# Altium schematic sheet SD Card.SchDoc
size A; SheetNumber: 3; SheetTotal: 7
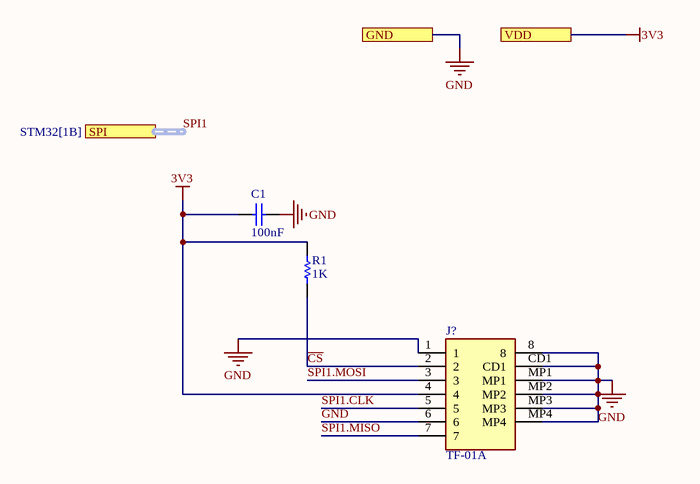
[diagram p0: SD Card.SchDoc]

## Parts
C1  value 100nF  (hidden comment: Capacitor)
J?  TF-01A  [TF01A]
R1  value 1K  (hidden comment: Resistor)

## Ports
GND, SPI (harness SPI Connection, see STM32[1B]), VDD

## Nets
3V3: C1.1 J?.4 R1.2 ; port VDD
GND: C1.2 J?.1 J?.6 J?.8 J?.CD1 J?.MP1 J?.MP2 J?.MP3 J?.MP4 ; port GND
~{CS}: J?.2 R1.1
SPI1.CLK: J?.5
SPI1.MISO: J?.7
SPI1.MOSI: J?.3

## Buses and harness runs
harness SPI1 = port SPI

## Library data of the parts
C1 = Capacitor: SimulationGenericComponent: True
J? = TF-01A: Connector; Manufacturer_Name: Korean Hroparts Elec; Datasheet Link: https://datasheet.lcsc.com/szlcsc/1903221101_Korean-Hroparts-Elec-TF-01A_C91145.pdf; Height: 1.85mm; Manufacturer_Part_Number: TF-01A
R1 = Resistor: TC1: 0; SimulationGenericComponent: True; TC2: 0